# EAGLE board FishTankControllerV2 (EAGLE 9.6.2)
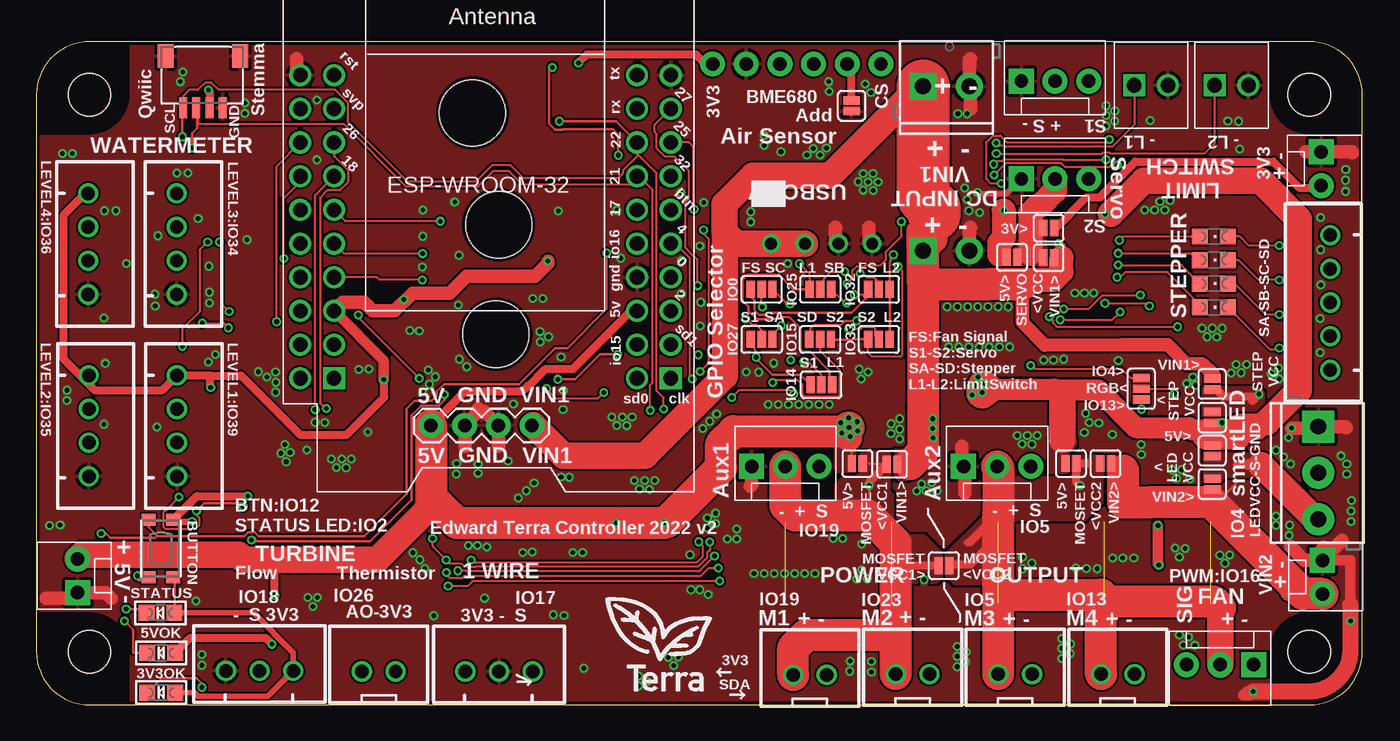
[diagram p2: board, top side]
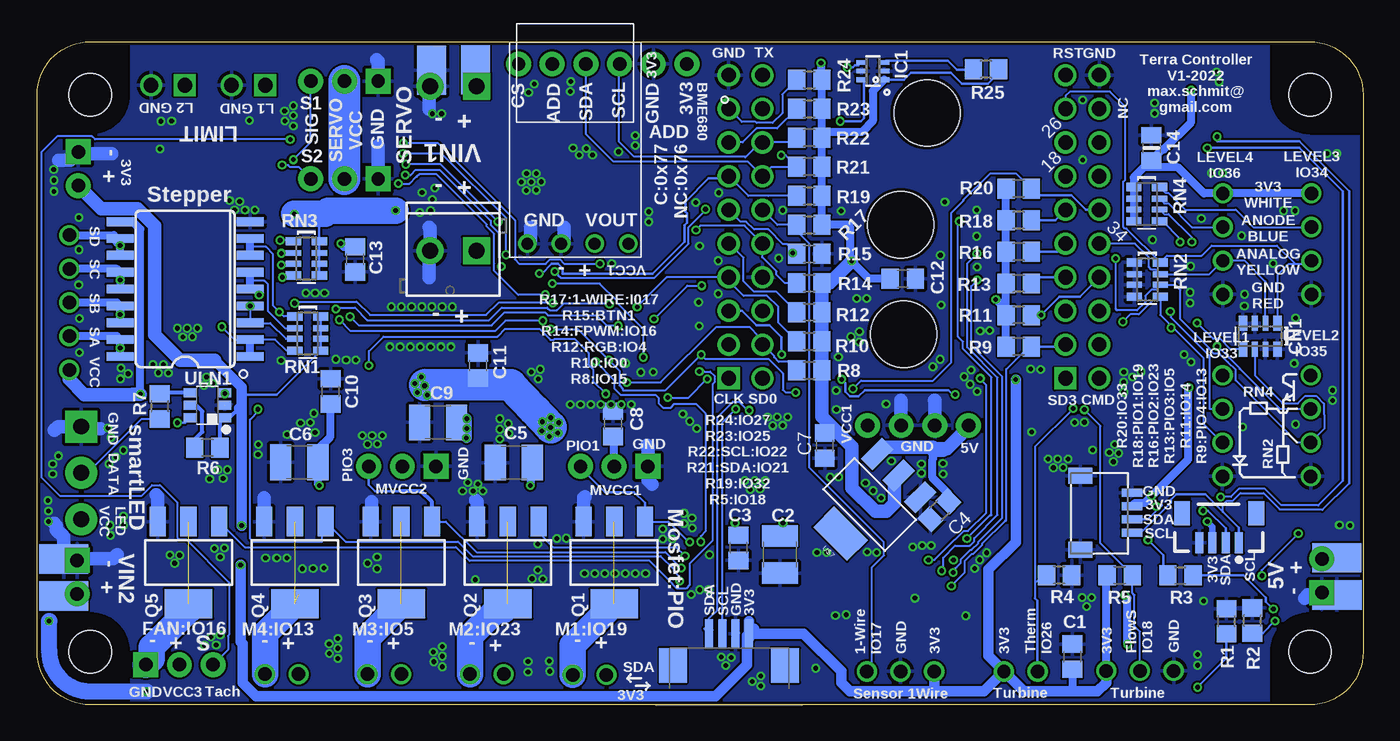
[diagram p3: board, bottom side, seen from below]

Size 100 x 50 mm. Coordinates in mm from the lower left corner, seen from the top.
Copper layers (1*16): Top 0.035mm / dielectric 1.5mm / Bottom 0.035mm
Design rules "dirt_cheap_dirty_boards.v2 *": minimum track width 6mil, minimum drill 12mil, track to track 6mil, track to pad 6mil, pad to pad 6mil, via to via 6mil, smd to smd 0mil, copper to edge 10mil, drill to drill 10mil, minimum pad ring 10mil, minimum via ring 6mil, stop-mask expansion 2mil, vias tented up to drill 25mil, thermal gap 10mil
Net classes: 0 default: clearance 0.127 mm; 1 power: width 0.127 mm, drill 0.305 mm; 2 lowpower: width 0.254 mm, drill 0.483 mm; 3 usbvcc: width 0.127 mm, drill 0.305 mm, clearance 0.254 mm to class 0, clearance 0.254 mm to class 1, clearance 0.254 mm to class 2, clearance 0.254 mm; 4 ThermoDiode: clearance 0.025 mm
Holes 5 mm at 34.86,36.2 32.88,44.63 34.66,27.95

## Footprints (pad centres in the part's own frame; a part is rotated, then mirrored left to right if it is on the bottom)
CHIPLED_0805 = smd 1.2 x 1.2: A 0,-1.05; C 0,1.05
DBV-R-PDSO-G6 = smd 0.69 x 0.99: 1 -0.95,-1.29; 2 0,-1.29; 3 0.95,-1.29; 4 0.95,1.3; 5 0,1.3; 6 -0.95,1.3
TESTHOOK = smd 2.2 x 3.7: P$1 0,0
BTN_KMR2_4.6X2.8 = smd 0.914 x 1.041: A 2.177,0.927; A' -2.177,0.927; B 2.177,-0.927; B' -2.177,-0.927
C805 = smd 1.3 x 1.5: 1 -0.95,0; 2 0.95,0
C1210 = smd 1.6 x 2.7: 1 -1.4,0; 2 1.4,0
0805-NO = smd 1.24 x 1.5: 1 -0.95,0; 2 0.95,0
RN8P-4R-CRA06S = smd 0.63 x 1.15: 1 -1.295,-0.975; 4 1.295,-0.975; 5 1.295,0.975; 8 -1.295,0.975 | smd 0.44 x 1.15: 2 -0.4,-0.975; 3 0.4,-0.975; 6 0.4,0.975; 7 -0.4,0.975
JST_SH4 = smd 0.6 x 1.55: 1 -1.5,2.514; 2 -0.5,2.514; 3 0.5,2.514; 4 1.5,2.514 | smd 1.2 x 1.8: MT1 -2.8,-1.386; MT2 2.8,-1.386
SC70-6L = smd 0.35 x 0.8: 1 -0.65,-0.85; 2 0,-0.85; 3 0.65,-0.85; 4 0.65,0.85; 5 0,0.85; 6 -0.65,0.85
SMT-JUMPER_3_2-NC_PASTE_SILK = smd 0.635 x 1.27: 1 -0.813,0; 2 0,0; 3 0.813,0
MOLEX-1X3 = drill 1.016 pad 1.88 square: 1 0,0 | drill 1.016 pad 1.88: 2 2.54,0; 3 5.08,0
MOLEX-1X2 = drill 1.016 pad 1.88 square: 1 0,0 | drill 1.016 pad 1.88: 2 2.54,0
SCREWTERMINAL-3.5MM-3 = drill 1.2 pad 2.413 square: 1 0,0 | drill 1.2 pad 2.413: 2 3.5,0; 3 7,0
SCREWTERMINAL-3.5MM-2 = drill 1.2 pad 2.032 square: 1 0,0 | drill 1.2 pad 2.032: 2 3.5,0
CONN_282834-2 = drill 1.1 square: 1 -1.27,0 | drill 1.1: 2 1.27,0
1X06_NO_SILK = drill 1.016 pad 1.88: 1 0,0; 2 2.54,0; 3 5.08,0; 4 7.62,0; 5 10.16,0; 6 12.7,0
1X04 = drill 1.016 pad 1.88: 1 0,0; 2 2.54,0; 3 5.08,0; 4 7.62,0
JST-4-SMD-VERT-1.0MM = smd 0.6 x 1.55: 1 -2.54,1.27; 2 -1.54,1.27; 3 -0.547,1.27; 4 0.46,1.27 | smd 1.2 x 1.8: P$1 -3.84,-0.955; P$2 1.753,-0.955
SMT-JUMPER_2_NC_PASTE_SILK = smd 0.635 x 1.27: 1 -0.406,0; 2 0.406,0
FPC_CONN_DOC_4PIN_ENLARGED = smd 0.6 x 2.2: 1 -1.5,1.1; 2 -0.5,1.1; 3 0.5,1.1; 4 1.5,1.1 | smd 2.105 x 2.6: Z1 -4.227,-1.3; Z2 4.227,-1.3
JST-XH-04-PACKAGE-ROUND-PAD = drill 1.016: 1 -3.81,0; 2 -1.27,0; 3 1.27,0; 4 3.81,0
DP10050_V1 = hole 3.2: -46,-21; 46,-21; 46,21; -46,21
SOT223 = smd 1.219 x 2.235: 1 -2.311,-3.099; 2 0,-3.099; 3 2.311,-3.099 | smd 3.6 x 2.2: 4 0,3.099
R805 = smd 1.3 x 1.5: 1 -0.95,0; 2 0.95,0
LED-805 = smd 1.2 x 1.2: A 0,-1.05; C 0,1.05
MH-ET_ESP32_D1_MINI = drill 1.11 pad 1.665: 3V3 25.4,-5.08; CMD 27.94,0; GND 0,-22.86; GND2 2.54,-7.62; GND3 27.94,-22.86; IO0 0,-7.62; IO2 0,-5.08; IO4 0,-10.16; IO5 25.4,-7.62; IO16 2.54,-10.16; IO17 2.54,-12.7; IO18 25.4,-15.24; IO19 25.4,-12.7; IO21 2.54,-15.24; IO22 2.54,-17.78; IO23 25.4,-10.16; IO25 0,-17.78; IO26 25.4,-17.78; IO27 0,-20.32; IO32 0,-15.24; IO33 27.94,-12.7; IO34 27.94,-10.16; IO35 27.94,-15.24; NC 27.94,-20.32; NC2 27.94,-5.08; RST 25.4,-22.86; RXD 2.54,-20.32; SD0 2.54,0; SD1 0,-2.54; SD2 27.94,-2.54; SVN 27.94,-17.78; SVP 25.4,-20.32; TCK 25.4,-2.54; TD0 2.54,-2.54; TDI 0,-12.7; TMS 27.94,-7.62; TXD 2.54,-22.86; VCC 2.54,-5.08 | drill 1.11 pad 1.665 square: CLK 0,0; SD3 25.4,0
USB-PDTRIGGER = drill 0.9: P$1 -3.683,-0.254; P$2 -1.143,-0.254; P$3 1.397,-0.254; P$4 3.937,-0.254
SO18L = smd 0.66 x 2.032: 1 -0.635,-4.902; 2 0.635,-4.902; 3 1.905,-4.902; 4 3.175,-4.902; 5 4.445,-4.902; 6 5.715,-4.902; 7 6.985,-4.902; 8 8.255,-4.902; 9 9.525,-4.902; 10 9.525,4.902; 11 8.255,4.902; 12 6.985,4.902; 13 5.715,4.902; 14 4.445,4.902; 15 3.175,4.902; 16 1.905,4.902; 17 0.635,4.902; 18 -0.635,4.902
JST-XH-02-PACKAGE-ROUND-PAD = drill 1.016: 1 -1.27,0; 2 1.27,0
JST-XH-03-PACKAGE-ROUND-PAD = drill 1.016: 1 -2.54,0; 2 0,0; 3 2.54,0
JST-XH-05-PACKAGE-ROUND-PAD = drill 1.016: 1 -5.08,0; 2 -2.54,0; 3 0,0; 4 2.54,0; 5 5.08,0

## Placement (x,y rotation side)
3V3OK  RED  [CHIPLED_0805]  9.41,0.92 90 top
5VOK  RED  [CHIPLED_0805]  9.41,3.92 90 top
74LVC1  IC_BUFF_SN74LVC1T45DBV  [DBV-R-PDSO-G6]  87.16,22.59 90 bottom
$$U$1  TESTHOOK  [TESTHOOK]  1.99,11.08 90 bottom
BUTTON  KMR2  [BTN_KMR2_4.6X2.8]  9.39,11.79 90 top
C1  [C805]  21.93,3.64 90 bottom
C2  [C1210]  43.98,11.33 270 bottom
C3  [C805]  47.1,11.84 90 bottom
C4  10uf  [C805]  31.95,14.66 225 bottom
C5  [C1210]  64.05,18.27 180 bottom
C6  [C1210]  80.23,18.29 180 bottom
C7  10uf  [C805]  40.6,19.54 270 bottom
C8  [C805]  56.55,21.19 270 bottom
C9  100uf  [C1210]  69.76,21.29 180 bottom
C10  [C805]  77.86,23.63 270 bottom
C11  4,7uf  [C805]  66.74,25.58 90 bottom
C12  4,7uf  [C805]  34.71,32.14 0 bottom
C13  [C805]  76.01,33.59 90 bottom
C14  4,7uF  [0805-NO]  15.96,41.99 90 bottom
CN1  [RN8P-4R-CRA06S]  7.76,27.79 180 bottom
CONN1  STEMMA_I2C_QT  [JST_SH4]  12.56,47.53 180 top
CONN2  STEMMA_I2C_QT  [JST_SH4]  19.94,14.49 270 bottom
IC1  LTC4311_SC70  [SC70-6L]  36.97,47.78 90 bottom
IO0  JUMPER-SMT_3_2-NC_PASTE_SILK  [SMT-JUMPER_3_2-NC_PASTE_SILK]  54.7,31.34 0 top
IO14  JUMPER-SMT_3_2-NC_PASTE_SILK  [SMT-JUMPER_3_2-NC_PASTE_SILK]  59.19,24.14 0 top
IO15  JUMPER-SMT_3_2-NC_PASTE_SILK  [SMT-JUMPER_3_2-NC_PASTE_SILK]  59.11,27.55 0 top
IO25  JUMPER-SMT_3_2-NC_PASTE_SILK  [SMT-JUMPER_3_2-NC_PASTE_SILK]  59.12,31.34 180 top
IO27  JUMPER-SMT_3_2-NC_PASTE_SILK  [SMT-JUMPER_3_2-NC_PASTE_SILK]  54.7,27.55 180 top
IO32  JUMPER-SMT_3_2-NC_PASTE_SILK  [SMT-JUMPER_3_2-NC_PASTE_SILK]  63.54,31.34 0 top
IO33  JUMPER-SMT_3_2-NC_PASTE_SILK  [SMT-JUMPER_3_2-NC_PASTE_SILK]  63.54,27.55 0 top
J1  [MOLEX-1X3]  91.81,3.03 180 top
J2  [MOLEX-1X2]  3.11,8.46 90 top
J3  [MOLEX-1X2]  96.99,10.9 270 top
J4  [SCREWTERMINAL-3.5MM-3]  96.69,20.99 270 top
J5  [MOLEX-1X2]  96.89,41.69 270 top
J6  [SCREWTERMINAL-3.5MM-2]  66.87,46.64 0 top
J7  282834-2  [CONN_282834-2]  84.06,46.72 0 top
J8  282834-2  [CONN_282834-2]  90.13,46.72 0 top
J9  [1X06_NO_SILK]  63.69,48.32 180 top
J10  [SCREWTERMINAL-3.5MM-2]  66.87,34.25 180 bottom
J11  [1X04]  29.76,21.06 0 top
J12  [JST-4-SMD-VERT-1.0MM]  11.9,13.49 180 bottom
JP1  JUMPER-SMT_2_NC_PASTE_SILK  [SMT-JUMPER_2_NC_PASTE_SILK]  68.44,10.5 0 top
JP3  JUMPER-SMT_2_NC_PASTE_SILK  [SMT-JUMPER_2_NC_PASTE_SILK]  88.67,16.64 270 top
JP4  JUMPER-SMT_2_NC_PASTE_SILK  [SMT-JUMPER_2_NC_PASTE_SILK]  64.53,18.14 0 top
JP5  JUMPER-SMT_2_NC_PASTE_SILK  [SMT-JUMPER_2_NC_PASTE_SILK]  61.91,18.19 180 top
JP6  JUMPER-SMT_2_NC_PASTE_SILK  [SMT-JUMPER_2_NC_PASTE_SILK]  78.02,18.19 180 top
JP7  JUMPER-SMT_2_NC_PASTE_SILK  [SMT-JUMPER_2_NC_PASTE_SILK]  80.63,18.19 0 top
JP8  JUMPER-SMT_2_NC_PASTE_SILK  [SMT-JUMPER_2_NC_PASTE_SILK]  88.67,19.16 90 top
JP9  JUMPER-SMT_2_NC_PASTE_SILK  [SMT-JUMPER_2_NC_PASTE_SILK]  88.67,21.67 270 top
JP10  JUMPER-SMT_2_NC_PASTE_SILK  [SMT-JUMPER_2_NC_PASTE_SILK]  88.67,24.19 90 top
JP11  JUMPER-SMT_2_NC_PASTE_SILK  [SMT-JUMPER_2_NC_PASTE_SILK]  76.34,33.71 0 top
JP12  JUMPER-SMT_2_NC_PASTE_SILK  [SMT-JUMPER_2_NC_PASTE_SILK]  73.57,33.74 180 top
JP13  JUMPER-SMT_2_NC_PASTE_SILK  [SMT-JUMPER_2_NC_PASTE_SILK]  76.34,35.95 0 top
JP14  JUMPER-SMT_2_NC_PASTE_SILK  [SMT-JUMPER_2_NC_PASTE_SILK]  61.48,45.17 270 top
K1  FPC4PIN_1MM_MAX  [FPC_CONN_DOC_4PIN_ENLARGED]  47.82,4.27 0 bottom
LEVEL1-IO39  JST-XH-04-PIN-ROUND-PAD  [JST-XH-04-PACKAGE-ROUND-PAD]  10.6,21.04 270 top
LEVEL2-IO35  JST-XH-04-PIN-ROUND-PAD  [JST-XH-04-PACKAGE-ROUND-PAD]  3.95,21.04 270 top
LEVEL3-IO34  JST-XH-04-PIN-ROUND-PAD  [JST-XH-04-PACKAGE-ROUND-PAD]  3.9,34.75 270 top
LEVEL4-IO36  JST-XH-04-PIN-ROUND-PAD  [JST-XH-04-PACKAGE-ROUND-PAD]  10.58,34.75 270 top
PCB1  PCB_DP_RECTANGLE-50X100  [DP10050_V1]  50,25 0 top
Q1  VNN7NV04  [SOT223]  56.48,10.73 180 bottom
Q2  VNN7NV04  [SOT223]  64.5,10.73 180 bottom
Q3  VNN7NV04  [SOT223]  72.53,10.73 180 bottom
Q4  VNN7NV04  [SOT223]  80.56,10.73 180 bottom
Q5  VNN7NV04  [SOT223]  88.58,10.73 180 bottom
R1  1k  [R805]  10.3,6.31 90 bottom
R2  1k  [R805]  8.34,6.36 90 bottom
R3  1k  [R805]  13.78,9.76 0 bottom
R4  10k  [R805]  22.92,9.79 180 bottom
R5  10k  [R805]  18.35,9.79 0 bottom
R6  [R805]  87.16,19.39 180 bottom
R7  330  [R805]  90.74,22.51 90 bottom
R8  10k  [R805]  41.76,25.23 0 bottom
R9  10k  [R805]  25.97,27.01 180 bottom
R10  10k  [R805]  41.76,27.42 0 bottom
R11  10k  [R805]  25.97,29.39 180 bottom
R12  10k  [R805]  41.76,29.61 0 bottom
R13  10k  [R805]  25.97,31.77 180 bottom
R14  10k  [R805]  41.76,31.81 0 bottom
R15  10K  [R805]  41.76,34 0 bottom
R16  10k  [R805]  25.97,34.15 180 bottom
R17  4,7k  [R805]  41.76,36.19 0 bottom
R18  10k  [R805]  25.97,36.54 180 bottom
R19  10k  [R805]  41.76,38.37 0 bottom
R20  10k  [R805]  25.97,38.92 180 bottom
R21  [R805]  41.76,40.56 180 bottom
R22  [R805]  41.76,42.75 180 bottom
R23  10k  [R805]  41.76,44.94 0 bottom
R24  10k  [R805]  41.76,47.12 0 bottom
R25  10K  [R805]  28.44,47.91 180 bottom
RGB  JUMPER-SMT_3_2-NC_PASTE_SILK  [SMT-JUMPER_3_2-NC_PASTE_SILK]  83.32,23.83 90 top
RN1  [RN8P-4R-CRA06S]  79.59,28 270 bottom
RN2  4,3k  [RN8P-4R-CRA06S]  16.27,32.06 270 bottom
RN3  [RN8P-4R-CRA06S]  79.69,33.66 270 bottom
RN4  330  [RN8P-4R-CRA06S]  16.32,37.75 270 bottom
S1  [LED-805]  88.8,29.98 270 top
S2  [LED-805]  88.8,31.76 270 top
S3  [LED-805]  88.8,33.53 270 top
S4  [LED-805]  88.8,35.31 270 top
SERVO1  [MOLEX-1X3]  53.94,17.98 0 top
SERVO2  [MOLEX-1X3]  69.91,17.98 0 top
SERVO3  [MOLEX-1X3]  74.28,39.66 0 top
SERVO4  [MOLEX-1X3]  74.28,47.02 0 top
STATUS  RED  [CHIPLED_0805]  9.36,6.94 90 top
U$1  LOGOTOPTERRA  [LOGOTOPTERRA]  46.72,0.95 0 top
U$3  MH-ET_ESP32_D1_MINI  [MH-ET_ESP32_D1_MINI]  47.84,24.62 180 top
U$4  TESTHOOK  [TESTHOOK]  98.01,8.21 90 bottom
U$5  TESTHOOK  [TESTHOOK]  1.97,8.29 270 bottom
U$6  TESTHOOK  [TESTHOOK]  98.01,11 270 bottom
U$7  V_REG_LD1117VXXLD1117-SMD  [SOT223]  37.22,15.1 135 bottom
U$8  USB_PD_TRIGGER  [USB-PDTRIGGER]  59.35,35.03 0 bottom
U$9  TESTHOOK  [TESTHOOK]  70.24,47.83 0 bottom
U$10  TESTHOOK  [TESTHOOK]  66.94,47.89 0 bottom
ULN1  STEPPER-DRIVER  [SO18L]  88.84,26.91 90 bottom
X1  JST-XH-02-PIN-ROUND-PAD  [JST-XH-02-PACKAGE-ROUND-PAD]  58.33,2.27 0 top
X2  JST-XH-02-PIN-ROUND-PAD  [JST-XH-02-PACKAGE-ROUND-PAD]  66.09,2.32 0 top
X3  JST-XH-02-PIN-ROUND-PAD  [JST-XH-02-PACKAGE-ROUND-PAD]  73.82,2.32 0 top
X4  JST-XH-02-PIN-ROUND-PAD  [JST-XH-02-PACKAGE-ROUND-PAD]  81.55,2.32 0 top
X5  JST-XH-03-PIN-ROUND-PAD  [JST-XH-03-PACKAGE-ROUND-PAD]  34.89,2.52 0 top
X6  JST-XH-02-PIN-ROUND-PAD  [JST-XH-02-PACKAGE-ROUND-PAD]  25.82,2.52 0 top
X7  JST-XH-03-PIN-ROUND-PAD  [JST-XH-03-PACKAGE-ROUND-PAD]  16.83,2.57 0 top
X8  JST-XH-05-PIN-ROUND-PAD  [JST-XH-05-PACKAGE-ROUND-PAD]  97.57,30.33 90 top

## Tracks (layer width: path | path; a pad name or v marks a point on that pad's centre or on a via)
1-WIRE
  Bottom 0.152: U$3.IO17 44.17,36.19 R17.1 42.71,35.72 41.75,34.77 41.75,17.88 36.14,12.27 36.14,11.73 36.13,11.73 36.13,11.27 37.05,10.36 37.05,2.9 X5.3
3V3  (via drill 0.35)
  Top 0.2: BUTTON.B' 10.41,9.52 STATUS.A | 25.06,30 25.67,30 25.97,29.7 | 25.08,29.7 25.36,29.7 | v27.7,30.56 27.7,30.39 27.01,29.7
  Top 0.4: STATUS.A 16.37,6.94 19.37,3.94 X7.3 17.44,0.65 12.2,0.65 11.93,0.92 3V3OK.A
  Top 0.5: v11.75,13.82 10.46,13.82 BUTTON.B
  Top 0.6: LEVEL2-IO35.1 3.26,24.85 | 3.26,24.85 4.38,23.73 9.49,23.73 LEVEL1-IO39.1 13.12,24.85 13.12,24.82 | 3.26,24.85 2.07,26.04 2.07,36.94 3.7,38.56 LEVEL3-IO34.1 | 13.12,24.82 15.43,24.82 19.88,20.38 23.41,20.38 26.23,23.2 26.23,24.49 v26.2,24.52 | 25.97,29.7 25.08,29.7 24.92,29.86 | v13.14,23.93 13.12,23.96 13.12,24.82 | BUTTON.B 12.09,15.75 v15.96,15.75 | v12.97,46.36 13.06,46.27 CONN1.2 | JP13.2 76.87,35.95 79.19,38.26 80.19,38.26 82.88,40.95 93.28,40.95 95.24,39 96.74,39 J5.2 | J9.6 50.46,48.32 49.75,49.03 41.52,49.03 v40.88,48.39
  Top 0.8: U$3.3V3 26.2,25.94 v26.2,24.52 | v84.65,10.55 84.57,10.62 v84.57,13.52
  Top 1: U$3.3V3 23.11,30.37 24.69,30.37 25.06,30 25.36,29.7 25.97,29.7 27.01,29.7 28.36,31.05 28.38,31.03 31.16,31.03 32.45,32.31 37.61,32.31 38.57,33.28 v38.57,33.46
  Bottom 0.2: RN1.8 RN1.7 RN1.6 RN1.5 81.94,23.37 84.49,23.37 84.57,23.3 | IC1.1 34.62,47.13 34.09,47.67 31.09,47.67 30.26,46.84 28.28,46.84 27.49,47.64 R25.1 | C14.1 16.02,41.04 16.55,40.52 | 74LVC1.1 85.51,21.64
  Bottom 0.3: R6.1 86.21,21.3 74LVC1.1 | 85.51,21.64 84.77,22.38 84.57,22.58
  Bottom 0.4: 46.32,5.04 K1.4
  Bottom 0.5: J12.3 11.35,13.43 v11.75,13.82
  Bottom 0.6: R9.2 R11.2 26.92,29.79 | 26.92,29.79 R13.2 R16.2 R18.2 R20.2 | v27.7,30.56 26.92,29.79 | LEVEL3-IO34.1 LEVEL4-IO36.1 12,38.56 13.96,40.52 16.55,40.52 17.29,39.77 RN4.1 RN4.2 RN4.3 RN4.4 | 40.81,43.19 R22.1 R21.1 R19.2 R17.2 38.86,36.19 38.67,36 38.67,33.56 v38.57,33.46 37.25,32.14 C12.1 | 40.81,43.19 R23.2 R24.2 40.88,47.2 v40.88,48.39 | 40.81,30.92 R14.2 | X7.3 19.37,9.72 R5.1 | CONN2.2 17.18,15.23 16.47,15.23 v15.96,15.75 13.2,18.51 13.2,23.88 v13.14,23.93 | C1.1 21.93,1.02 | C7.1 40.6,21.55 40.79,21.74 | IC1.1 36.97,46.28 36.97,44.02 37.81,43.19 40.81,43.19 | C14.1 15.14,41.87 15.03,41.87 12.97,43.93 v12.97,46.36
  Bottom 0.8: 46.32,5.04 46.32,6.3 | K1.4 45.93,5.75 | v26.2,24.52 26.2,12.27 28.26,10.22 28.26,3.69 X6.2 | X6.2 25.59,1.02 21.93,1.02 20.03,1.02 19.37,1.68 X7.3 19.3,2.64 | X6.2 28.59,1.02 32.32,1.02 | 32.32,1.02 38.7,1.02 39.36,1.68 39.36,2.52 42.21,5.37 K1.4 | K1.4 46.46,5.23 46.46,3.03 48.84,0.65 83.49,0.65 84.49,1.66 84.49,4.6 84.65,4.76 v84.65,10.55 | v84.57,13.52 84.57,22.18 | 86.6,25.99 84.57,23.96 84.57,23.3 84.57,22.58 84.57,22.18 | X5.1 32.35,1.05 32.32,1.02 | 84.57,22.18 84.77,22.38
  Bottom 1: J5.2 95.15,37.41 92.41,37.41 91.12,36.13 91.12,27.92 89.19,25.99 86.6,25.99 | U$7.2 35.35,16.96 35.35,15.18 35.93,14.61 36.79,14.61 38.53,16.35 38.53,19.48 40.79,21.74 40.81,21.75 R8.2 R10.2 R12.2 40.81,30.92 | R14.2 40.22,31.81 v38.57,33.46
5V  (via drill 0.35)
  Top 0.152: JP5.2 61.51,20.68 v61.28,20.91 | v60.67,21.27 61.02,20.91 v61.28,20.91 | v60.72,20.5 61.13,20.91 v61.28,20.91 | JP12.2 72.82,33.74 72.61,33.95 | J11.1 29.76,21.11
  Top 0.2: 77.37,20 77.83,19.54 | v89.42,21.27 90.26,20.43 90.61,20.43
  Top 0.4: v43.75,13.72 43.75,13.14 | v47.36,13.72 47.56,13.52 47.56,13.14 47.57,13.14 47.57,13.8
  Top 0.6: U$3.VCC 44.84,29.7 40.48,25.34 38.41,25.34 37.1,24.04 37.04,24.04 36.64,23.64 32.25,23.64 32.25,23.56 J11.1 | 5VOK.A 11.6,5.06 17.28,5.06 v17.77,4.58 | v17.97,8.26 17.97,10.65 17.67,10.96 | 71.03,24.31 v71.03,24.72 | 71.03,24.31 v70.78,24.06 71.41,24.06 71.67,23.81 | v71.51,24.24 71.11,24.24 71.03,24.31 | v60.67,21.27 60.87,21.27 v61.25,21.65 | v61.89,21.34 61.94,21.29 v61.94,20.66 61.53,20.66 v61.28,20.91 | 88.67,20.9 JP9.2 v89.42,21.27 89.78,21.27 90.51,20.53 | 88.67,20.9 88.2,20.43 | 88.79,21.01 88.67,20.9 | JP8.2 88.2,20.03 88.2,20.25 88.2,20.43 | 90.61,20.43 90.51,20.53 | 90.61,20.43 90.94,20.76 90.94,21.67 | 92.8,21.32 92.8,21.06 92.7,20.96 92.01,20.96 | 90.61,20.43 90.61,20.76 90.28,20.43 88.2,20.43 | 90.61,20.43 90.61,20.25 | 90.74,20.96 90.54,20.96 90.51,20.94 90.51,20.53 | v80.61,37.01 81.04,37.01
  Top 1.6: 76.8,23.76 80.07,23.76 82.92,20.91 86.93,20.91 87.08,20.76 90.61,20.76 | 71.67,23.81 76.75,23.81 76.8,23.76 | 76.8,23.76 77.37,23.18
  Top 1.8: v72.96,37.27 72.96,35.16 72.61,34.81 72.61,33.95
  Top 2: 30.4,15.03 29.76,15.68 29.76,14.84 | 88.2,20.25 90.61,20.25 | 77.37,23.18 77.37,20 | v61.28,20.91 61.28,20.13 61.27,20.12 | 92.01,20.96 90.74,20.96 | 92.8,21.32 95.21,23.73 95.21,36.61 92.32,39.5 83.52,39.5 81.04,37.01 | J2.2 3.42,11.31 15.26,11.31 15.61,10.96 17.67,10.96 25.69,10.96 29.76,15.02
  Top 2.4: 29.76,14.84 29.76,15.02 29.76,21.11 | 30.4,15.03 31.71,13.72 v43.75,13.72 v47.36,13.72 | 47.57,13.8 51.64,17.88 51.64,19.68 52.6,20.63 61,20.63 v61.28,20.91 | v71.31,23.55 71.34,23.58 71.34,23.76 71.39,23.81 71.39,23.96 71.45,24.02 71.67,23.81
  Bottom 0.2: RN3.5 RN3.6 RN3.7 RN3.8 78.72,36.59 78.3,37.01 78.04,37.27 | v43.75,13.72 43.75,13.42 43.73,13.39 | v61.38,20.23 61.28,20.33 v61.28,20.91 | 74LVC1.6 88.83,21.27 v89.42,21.27 | $$U$1.P$1 3.04,11.08 J2.2 | 62.54,22.27 64.33,24.06 70.42,24.06 v70.78,24.06
  Bottom 0.4: 43.73,13.39 43.73,13.16 43.75,13.14 | C2.1 43.75,12.96 v43.75,13.72 | C3.2 47.36,13.05 v47.36,13.72
  Bottom 0.6: v17.77,4.58 17.77,8.06 v17.97,8.26 | v71.31,23.55 71.21,23.55 71.01,23.35 v70.57,23.35 | C11.1 69.85,24.63 70.42,24.06 | C4.1 31.28,15.93 32.47,17.12 32.47,18.53 32.42,18.57 32.42,19.21 32.42,19.44
  Bottom 1: U$7.3 36.15,19.44 34.86,19.44 32.42,19.44 | 31.69,19.21 32.42,19.21 32.31,19.32 31.38,19.32 29.76,20.95 J11.1
  Bottom 2: v80.61,37.01 78.3,37.01 | 78.04,37.27 v72.96,37.27
  Bottom 2.4: 70.76,24.13 64.27,24.11 62.54,22.27 61.28,20.94 v61.28,20.91
  pour Top (no thermals): 76.34,19.89 76.34,17.46 77.79,17.48 77.84,17.53 77.84,19.01 78.42,19.59 78.42,19.97 78.24,20.15 76.49,20.15 76.31,19.97
  pour Top (no thermals): 62.04,19.64 61.73,19.34 61.73,17.53 60.44,17.53 60.19,17.79 60.19,19.77 60.26,19.84 61.94,19.84 62.04,19.74
ANODEA0  (via drill 0.35)
  Top 0.152: v13.8,34.91 13.98,34.73 13.98,30.21 v14.54,29.65
  Bottom 0.152: RN4.5 15.12,36.46 13.8,35.15 v13.8,34.91 | v14.54,29.65 14.52,29.62 14.52,29.24 11.6,26.32 11.6,22.31 LEVEL1-IO39.2
ANODEA1  (via drill 0.35)
  Top 0.152: v12.92,34.91 12.31,34.3 12.31,29.64 11.01,28.35 v11.01,27.03
  Bottom 0.152: RN4.6 14.99,37 14.67,37 12.92,35.24 v12.92,34.91 | LEVEL2-IO35.2 6.29,22.31 9.31,25.33 9.31,25.38 10.09,26.17 10.1,26.17 10.71,26.78 10.76,26.78 v11.01,27.03
ANODEA2
  Bottom 0.152: RN4.7 14.99,37.8 14.67,37.8 12.9,36.02 LEVEL4-IO36.2
ANODEA3
  Bottom 0.152: RN4.8 14.9,38.6 14.67,38.6 13.42,37.34 9.61,37.34 8.29,36.02 LEVEL3-IO34.2
BTN1  (via drill 0.35)
  Top 0.152: v43.01,34.08 43.01,33.46
  Top 0.2: BUTTON.A 8.46,13.38 9.09,12.74 | 9.09,12.74 9.13,12.71 15.68,12.71 15.99,13.02 16.47,13.02 16.78,12.71 24.73,12.71 27.93,15.91 27.93,22.31 28.54,22.92 29.81,22.92 30.19,23.3 30.19,23.64 30.74,24.19 36.41,24.19 39.13,26.91 40.04,26.91 43.01,29.87 43.01,33.46 | v4.89,12.91 5.27,12.91 5.58,12.61 8.95,12.61 9.09,12.74
  Top 0.6: BUTTON.A' 7.75,9.62 v7.63,9.73
  Bottom 0.152: U$3.TDI 46.95,36.43 46.52,36.43 45.93,35.84 44.86,35.84 43.75,34.73 43.44,34.73 R15.1 42.78,34.08 v43.01,34.08
  Bottom 0.2: v7.63,9.73 7.63,10.17 v4.89,12.91
EN
  Bottom 0.2: IC1.3 35.99,48.56 31.32,48.56 30.65,47.89 29.41,47.89 R25.2
FANCOUNTER  (via drill 0.35)
  Top 0.152: 62.57,30.66 62.32,30.92 v61.68,30.92 | v72.76,39.3 72,39.3 71.64,39.66 71.64,42.42 72.15,42.92 72.7,42.92 | 72.7,42.92 72.71,42.93 | 72.7,42.92 73.19,42.43 73.19,42.42 73.2,42.41 80.7,42.41 v80.91,42.63
  Top 0.2: IO0.1 53.95,31.27 53.95,30.71 54.17,30.49 54.17,29.76 54.51,29.42 54.99,29.42 55.14,29.57 61.48,29.57 62.57,30.66 62.57,31.19 IO32.1
  Bottom 0.152: v61.68,30.92 63.72,30.92 65.54,32.74 65.54,33.28 65.53,33.29 65.53,35.5 66.1,36.07 66.1,36.22 69.89,40.01 71.16,40.01 71.36,39.81 71.41,39.81 71.92,39.3 v72.76,39.3 | v80.91,42.63 95.62,42.63 95.85,42.86 98.49,42.86 99.67,41.68 99.67,17.15 98.3,15.78 92.1,15.78 91.32,16.56 90.72,16.56 89.42,15.26 89.42,12.61 89.29,12.48 88.76,12.48 85.51,9.23 85.51,5.29 85.6,5.19 85.6,4.15 J1.3
FANGND  (1 unrouted)
  Bottom 2: J1.1 91.36,3.48 91.36,4.35 88.58,7.13 Q5.4
FANPWM  (via drill 0.35)
  Top 0.152: v50.31,35.79 50.31,35.51 50.69,35.13 50.69,25.76 v50.05,25.13
  Bottom 0.152: R14.1 | R14.1 43.62,31.81 44.24,32.42 44.24,32.68 45.3,33.74 U$3.IO16 46.65,36.13 49.97,36.13 v50.31,35.79 | Q5.1 84.34,11.89 68.41,11.89 67.37,10.85 53.81,10.85 52.08,9.12 52.08,9.1 51.75,8.77 51.06,8.77 50.79,9.05 50.79,10.65 49.06,12.38 49.06,24.19 48.91,24.34 48.91,24.8 49.24,25.13 49.7,25.13 49.87,24.95 50.23,24.95 v50.05,25.13
GND  (via drill 0.35)
  Top 0.4: SERVO3.1 73.16,38.54 71.05,38.54 v70.96,38.63
  Top 0.8: J3.1 99.07,10.9 99.07,7.5 | v91.76,1 91.48,0.72 91.02,0.72 91.3,1 v91.76,1
  Top 1: J3.1 98.46,12.38 98.46,12.43 | 99.25,41.64 99.2,41.69 J5.1 95.72,41.69 | 94.67,20.85 94.69,20.87 96.57,20.87 J4.1 98.69,20.99 98.79,20.89 | 69.81,19.49 69.81,18.08 SERVO2.1 70.02,17.88 70.02,16.01 | SERVO1.1 53.94,16.57 53.84,16.47 | 5.65,8.06 5.25,8.46 J2.1 2.71,8.06 0.75,8.06 | U$3.GND3 19.62,47.76 19.62,48.7 | U$8.P$1 62.8,35.01 62.8,36 | U$8.P$2 60.26,35.01 60.26,36 | J10.2 70.37,35.86 70.37,35.87 70.37,35.95 70.42,36 | 70.42,48.7 70.37,48.64 J6.2 70.42,46.59 70.42,44.89 | 33.36,22.13 J11.2 32.32,21.04 32.32,19.49 | 33.36,22.13 33.36,22.33 | 33.36,22.13 33.77,22.13 J11.3 34.86,21.04 34.86,19.49 | J3.1 95.6,10.9 94.59,11.91 | J3.1 96.99,11.77 97.09,11.87
  Top 1.2: 99.07,7.5 99.1,7.53 v99.1,6.33 99.1,4.17 arc-90 95.92,1 v91.76,1
  Bottom 0.2: U$5.P$1 2.93,8.29 J2.1
  Bottom 1: 93.97,11.34 94.3,11 U$6.P$1 98.01,12.68 98.54,13.22 98.54,13.52 98.72,13.7 | 94.37,41.56 96.76,41.56 J5.1 97.5,41.08 98.36,41.08 | SERVO4.1 74.28,48.52 74.38,48.62 | SERVO3.1 74.28,42.17 | Q4.3 82.87,15.6 | Q3.3 74.79,13.88 74.79,15.3 | Q2.3 66.81,15.3 66.94,15.42 | Q1.3 58.79,15.6 58.69,15.7 | Q5.3 90.89,15.7 91.02,15.83 | 95.24,20.81 96.51,20.81 J4.1 98.41,20.99 98.69,20.71 | 53.63,16.64 53.94,16.95 SERVO1.1 53.94,19.51 53.99,19.56 | U$5.P$1 4.15,8.29 4.38,8.06 | U$8.P$2 60.26,35.01 60.26,36 | U$8.P$1 62.8,35.01 62.8,36 | U$9.P$1 70.42,47.66 70.42,44.89 | 70.42,32.19 70.42,34.19 J10.2 70.37,35.94 70.42,36 | J11.3 34.84,22.95 34.86,22.98 | J11.2 32.3,22.95 32.32,22.98
  Bottom 1.2: v91.76,1 96,1 arc90 99.07,4.07 99.07,6.31 arc-90 v99.1,6.33
  other vias: 89.24,11.28 68.69,30.02 69.46,30.02 70.23,30.02 70.99,30.02 71.76,30.02 72.53,30.02 73.29,30.02 68.8,26.99 69.56,26.99 70.33,26.99 71.09,26.99 71.86,26.99 72.63,26.99 73.39,26.99 55.18,22.65 55.95,22.65 56.71,22.65 57.48,22.65 58.25,22.65 59.01,22.65 59.78,22.65 54.11,9.9 54.88,9.9 55.65,9.9 56.41,9.9 57.18,9.9 57.95,9.9 58.71,9.9 79.03,20.54 79.13,21.99 79.39,21.28 80.12,21.25 81.14,20.39 22.24,18.54 23.03,18.54 22.62,17.9 23.36,17.88 23.76,18.54 18.43,18.97 19.14,19.02 18.83,18.33 18.73,19.63 20.41,19.22 31.69,18.21 37.53,16.73 31.66,17.42 36.33,15.59 36.94,16.15 45.1,16.91 45.89,16.91 45.48,16.28 46.22,16.25 46.62,16.91 43.4,21.71 44.18,21.71 43.78,21.08 44.51,21.05 44.92,21.71 85.1,37.31 84.32,37.31 84.72,37.94 85.48,38.02 83.58,37.31 80.67,43.64 80.67,44.43 81.31,44.02 81.33,44.76 80.67,45.17 87.9,28.39 88.68,28.39 88.28,27.76 89.01,27.73 89.42,28.39 83.3,19.63 85.64,17.72 86.98,17.04 85.97,17.06 86.37,17.72 86.75,24.23 87.21,24.71 87.41,24.1 90.11,25.01 93.13,24.96 77.32,3.49 77.32,4.27 77.95,3.87 77.98,4.6 77.32,5.01 69.44,2.88 69.44,3.66 70.08,3.26 70.1,3.99 69.44,4.4 65.1,21.57 65.1,20.78 64.47,21.19 64.44,20.45 65.1,20.05 67.91,16.12 67.12,16.12 67.53,16.76 66.76,16.66 66.38,16.12 79.03,31.06 78.32,31.06 79.72,31.06 96.81,26.56 96.81,29.13 96.86,31.67 96.84,34.31 96.84,36.75 93.69,25.39 93.71,24.58 90.84,25.04 90.46,25.67 91.27,25.67 52.82,12.52 60.08,12.57 60.79,12.54 62.24,12.13 52.82,13.25 52.11,12.52 50.58,13.33 50.61,14.09 51.22,13.68 75.96,26 76.7,26 77.46,26.05 81.6,25.95 62.74,25.1 62.2,24.57 62.05,25.3 50.25,20.85 50.79,21.38 51.3,21.94 51.22,14.45 49.29,11.32 49.36,8.68 50.03,8.68 50.66,8.32 39.56,26.23 73.95,20.31 74.74,20.31 74.33,19.68 75.07,19.65 75.48,20.31 33.31,18.15 29.1,23.62 33.97,11.91 33.26,12.01 32.58,12.01 37.4,11.53 36.69,11.5 40.45,11.5 41.19,11.5 29.63,24.17 30.09,24.73 29.55,25.24 28.87,28.19 29.1,33.01 29.15,35.33 29.15,37.31 31.89,26.05 32.45,25.5 38.01,27.35 37.99,28.14 38.62,27.76 18.05,23.56 18.07,24.33 18.05,25.09 45.43,1.42 45.43,2.18 46.06,1.77 47.66,3.58 48.4,3.6 48.07,2.97 28.38,11.47 28.92,10.94 29.3,10.28 17.39,24.71 16.75,25.11 93.48,19.2 94.04,18.69 94.58,18.15 94.42,20.16 94.65,20.87 87.36,4.49 86.5,4.51 50.04,34.6 50.32,37.88 48.64,33.48 48.64,30.99 50.11,30.36 50.06,28.56 53.54,25.1 54.48,25.08 55.6,25.76 48.59,38.61 39.74,23.69 15.74,44.6 15.74,45.38 11.42,40.1 10.6,40.1 8.95,30.07 8.93,30.96 13.04,31.11 13.04,30.3 9.08,20.95 5.09,21.15 2.3,23.72 2.3,22.96 5.09,29.18 5.19,25.75 12.97,25.85 13.5,26.41 0.98,13.53 1.79,13.56 5.14,37.26 6.01,37.26 1.97,41.57 2.73,41.57 10.86,46.98 11.06,47.72 21.15,41.09 21.15,45.61 24.32,25.29 25.08,25.32 33.31,17.47 35.57,18.38 70,38.96 69.49,44.57 70.2,44.57 62.51,46.81 62.94,46.17 59.79,46.25 59.76,46.98 61.97,39.44 62.73,39.41 62.35,40.05 63.09,40.05 63.47,39.41 62.35,38.8 63.11,38.78 58.11,41.45 58.59,41.95 59.1,41.45 59.58,41.98 54.89,42.18 54.89,42.92 56.16,41.7 53.87,36.42 53.87,37.18 44.06,33.67 37.44,30.63 38.2,30.63 39.37,37.23 31.54,37.92 31.87,33.9 31.82,30.14 28.16,28.21 24.99,20.57 21.02,21.3 21.76,21.28 20.49,8.1 21.2,8.1 20.84,7.41 12.48,2.99 12.48,3.8 12.03,7.84 33.79,8.05 29.96,6.72 38.98,6.8 39.79,6.75 41.29,2.76 61.33,2.53 43.76,37.29 70.2,38.09 70.33,37.26 71.14,37.13 89.98,11.31 89.62,10.67 85.86,11.82 86.63,11.79 86.19,11.16 98.72,39.55 98.72,38.72 98.74,40.37 90.74,41.92 89.85,44.02 90.67,44 83.99,44.05 98.39,18.78 98.82,18.17 98.82,17.41 99.17,15.4 99.15,14.61 99.15,13.82 94.48,12.78 94.5,13.54 78.37,10.32 79.18,10.29 80,10.27 81.17,11.08 81.93,11.08 82.77,11.08 74.36,10.27 74.36,11.16 75.07,10.67 61.86,9.48 62.67,9.51 62.24,10.17 66.94,9.43 83.32,18.87 93.48,14.23 93.48,13.54 86.88,5.12 86.19,5.28 62.98,2.48 62.98,3.27 61.38,3.3 35.98,22.68 39.71,22.27 40.2,17.16 39.56,17.19 56.65,33.27 6.79,33.27 13.02,33.06 15.89,35.07 9.16,35.36 12.2,36.66
  pour Bottom: -1.97,49.97 -1.97,-8.45 95.82,-8.45 108.52,4.25 108.52,44.89 98.36,55.05 3.11,55.05
  pour Top (rank 2): -0.88,50.93 -0.88,-1.26 99.91,-1.26 100.65,-0.53 100.65,50.93
  pour Top: 91.76,6.94 91.78,6.94 91.76,7.83
IO0  (via drill 0.35)
  Top 0.152: v54.75,30 54.7,30.05 IO0.2
  Bottom 0.152: R10.1 44.11,28.82 44.11,30.01 44.94,30.84 46.72,30.84 47.84,31.96 U$3.IO0 52.51,32.24 v54.75,30
IO4  (via drill 0.35)
  Top 0.152: v74.97,25.58 75.04,25.58 75.32,25.31 81.85,25.31 82.51,24.64 RGB.3 | v57.11,23.45 56.83,23.73 53,23.73 v52.44,23.17 | v49.47,24.57 49.29,24.75 49.29,33.69 48.2,34.78 U$3.IO4
  Bottom 0.152: v74.97,25.58 74.97,26.68 73.88,27.77 65.29,27.77 64.71,28.35 62.12,28.35 61.28,27.52 61.05,27.52 60.98,27.59 59.47,27.59 58.43,26.55 58.43,25.66 58.08,25.31 58.08,24.42 v57.11,23.45 | v52.44,23.17 50.86,23.17 v49.47,24.57 | R12.1 44.24,31.15 45.94,31.15 46.72,31.93 46.72,33.71 47.79,34.78
  Bottom 0.2: U$3.IO4 47.79,34.78
IO14  (via drill 0.35)
  Top 0.152: IO14.2 59.19,24.9 58.2,25.89 v57.87,25.89 | v49.95,12.3 50.23,12.02 50.23,11.18 49.77,10.73 32.98,10.73 v32.78,10.93 | v28.87,24.62 24.29,29.2 v24.29,29.39
  Bottom 0.152: v57.87,25.89 56.48,24.49 56.48,23.86 55.99,23.37 53.35,23.37 53.12,23.15 53.12,22.74 52.79,22.41 52.21,22.41 51.93,22.69 50.3,22.69 49.59,21.98 49.59,13.09 49.95,12.73 v49.95,12.3 | v32.78,10.93 32.32,10.93 30.77,12.48 30.75,12.48 30.11,13.11 29.78,13.11 28.41,14.48 28.41,24.1 28.87,24.56 v28.87,24.62
  Bottom 0.2: R11.1 v24.29,29.39 22.89,30.78 21.36,30.78 U$3.TMS
IO15  (via drill 0.35)
  Top 0.152: IO15.2 59.11,26.71 60.55,25.27 60.55,23.36 60.45,23.25 57.96,23.25 57.77,23.44 57.77,24.14 57.44,24.47 55.69,24.47 v55.54,24.31
  Bottom 0.152: v55.54,24.31 52.97,24.31 48.78,28.51 46.29,28.51 45.55,27.77 45.55,27.41 U$3.TD0 44.41,26.27 44.41,26.19 44.08,25.87 43.35,25.87 R8.1
IO25  (via drill 0.35)
  Top 0.152: 58.85,31.6 IO25.2 59.39,31.6 59.39,32.13 59.93,32.67 v60.95,32.67 | v49.59,37.37 49.57,37.4 49.57,42.04 49.21,42.4 U$3.IO25
  Bottom 0.152: R23.1 44.18,43.46 45.74,43.46 46.8,42.4 U$3.IO25 | v49.59,37.37 49.59,37.29 50.86,36.02 50.86,34.77 53.45,32.19 60.5,32.19 60.7,32.38 60.7,32.42 v60.95,32.67
IO27  (via drill 0.35)
  Top 0.152: v53.48,29.09 53.53,29.09 53.99,28.63 54.32,28.63 54.7,28.26 IO27.2 | v49.87,31.6 49.87,33.56 49.57,33.86 49.57,33.84 48.96,34.45 48.96,37.93 49.21,38.18 49.21,40.27 48.14,41.34 47.4,41.34 46.78,41.96 46.78,43.05 46.62,43.21 46.62,43.72 U$3.IO27
  Bottom 0.152: R24.1 43.8,46.03 43.8,44.61 44.53,43.88 45.74,43.88 45.81,43.95 46.85,43.95 U$3.IO27 | v53.48,29.09 50.97,31.6 v49.87,31.6
IO32  (via drill 0.35)
  Top 0.2: v62.12,32.52 62.36,32.52 62.65,32.22 63.15,32.22 63.3,32.08 63.3,31.58 IO32.2
  Bottom 0.152: R19.1 44.86,38.37 44.86,38.38 46.36,38.38 47.68,39.69 U$3.IO32
  Bottom 0.2: v62.12,32.52 61.92,32.52 61.19,33.25 60.71,33.25 60.37,32.91 60.37,32.52 53.58,32.52 51.19,34.91 51.19,36.16 50.99,36.36 50.99,37.06 51.11,37.18 51.11,37.93 49.35,39.69 47.68,39.69
IO33  (via drill 0.35)
  Top 0.152: IO33.2 63.27,27.82 63.27,28.35 63.16,28.45 62.26,28.45 62.14,28.33 v61.28,28.33 | v42.79,23.55 42.33,23.1 39.2,23.1 v38.47,23.83
  Bottom 0.152: v61.28,28.33 59.22,28.33 v56.88,25.99 56.09,25.2 56.09,24.08 55.84,23.83 55.84,23.73 52.59,23.73 v49.92,26.4 49.62,26.09 44.84,26.09 43.75,25 43.75,23.76 43.55,23.55 v42.79,23.55 | v38.47,23.83 37.86,24.44 32.42,24.44 31.05,25.81 31.05,37.04 31.08,37.07 30.12,38.02 30.12,38.07 28.16,40.04 26.14,40.04 R20.1
  Bottom 0.2: R20.1 24.51,38.4 21.99,38.4 20.91,37.32 U$3.IO33
LED  (via drill 0.35)
  Top 0.2: v43.85,26.42 42.51,26.42 40.63,24.54 v39.33,24.54 | v30.77,23.4 30.77,23.02 30.32,22.57 29,22.57 28.28,21.85 28.28,15.47 25.16,12.35 16.63,12.35 16.55,12.44 v16.23,12.44
  Bottom 0.2: U$3.IO2 46.84,29.7 45.75,28.61 44.75,28.61 43.85,27.72 v43.85,26.42 | v39.33,24.54 39.05,24.26 39.05,23.59 38.71,23.25 38.06,23.25 37.58,23.73 31.28,23.73 30.95,23.4 v30.77,23.4 | 15.06,10.07 15.06,10.09 | 15.06,10.09 15.06,11.27 v16.23,12.44 | 14.57,9.92 R3.1 15.06,10.09
LEDVCC
  Top 0.152: 92.28,18.16 91.59,18.16
  Top 0.2: 92.37,18.07 92.28,18.16
  Top 0.6: 91.41,18.12 91.37,18.07 90.54,18.07 90.54,18.13
  Top 0.8: 91.59,18.16 91.45,18.16 91.41,18.12
  Top 2: J4.3 96.45,13.99 92.37,18.07
  pour Top (no thermals): 88.02,18.98 88.02,17.1 88.18,16.95 89.14,16.92 89.32,16.87 89.57,17.18 91.73,17.18 91.91,17.38 91.91,18.8 91.19,19.06 88.1,19.06
LEVEL1  (via drill 0.35)
  Top 0.152: v18.12,28.89 18.12,33.41 18.1,33.43 18.1,40.6 U$3.SVN | v12.51,28.78 14.14,28.78 v14.49,28.43
  Bottom 0.152: 14.41,28.53 15.29,29.41 RN2.5 15.6,30.77 16.92,29.45 17.56,29.45 v18.12,28.89 | 14.41,28.53 12.04,26.16 12.04,21.2 LEVEL1-IO39.3 | v12.51,28.78 11.31,27.59 10.78,27.59 10.01,26.82 CN1.5 | v14.49,28.43 14.49,28.46 14.41,28.53
LEVEL2  (via drill 0.35)
  Top 0.152: v18.66,33.66 18.66,38.21 19.9,39.45 U$3.IO35
  Bottom 0.152: v18.66,33.66 18.66,29.85 18.55,29.75 17.05,29.75 16.44,30.36 16.44,30.83 15.96,31.31 15.65,31.31 RN2.6 14.17,31.66 13.78,31.27 13.78,29.06 11.57,26.85 11.57,26.8 11.24,26.48 10.84,26.48 10.2,25.84 10.19,25.84 9.61,25.26 9.61,24.47 4.92,19.77 3.98,19.77 | LEVEL2-IO35.3 3.98,19.77 | CN1.6 8.16,24.84 6.11,22.79 6.11,22.74 4.92,22.74 4.36,23.3 3.54,23.3 2.96,22.72 2.96,21.9 2.91,21.85 2.91,20.83 3.98,19.77
LEVEL3
  Bottom 0.152: U$3.IO34 17.21,34.78 16.17,33.74 16.17,33.02 15.96,32.81 15.65,32.81 RN2.7 11.6,32.46 LEVEL4-IO36.3 8.93,33.48 7.36,31.92 CN1.2
LEVEL4
  Bottom 0.152: 5.12,33.26 6.49,34.63 11.42,34.63 12.18,33.86 14.79,33.86 RN2.8 17.85,35.91 17.96,35.91 18.1,36.05 18.1,39.46 17.95,39.61 17.95,45.09 19.09,46.23 22.11,46.23 22.44,45.9 U$3.SVP | 5.12,33.26 4.13,33.26 LEVEL3-IO34.3 | CN1.1 6.44,28.8 6.44,32.42 5.6,33.26 5.12,33.26
LIMIT1  (via drill 0.35)
  Top 0.152: J7.1 82.79,43.72 81.14,42.07 73.11,42.07 73.04,42.14 72.6,42.14 v72.38,42.37 | v57.54,33.26 58.31,32.49 IO25.3 | 59.82,25.15 58.4,26.58 57.84,26.58 57.66,26.76 57.66,28.34 56.78,29.22 56,29.22 55.88,29.09
  Top 0.2: IO14.3 59.82,24.33 59.82,25.15 | IO25.3 57.06,31.34 55.98,32.42 53.59,32.42 53.24,32.06 53.24,30.48 53.72,30.01 53.72,29.72 54.36,29.07 55.14,29.07 55.16,29.09 55.88,29.09
  Bottom 0.152: v72.38,42.37 69.81,42.37 63.97,36.53 63.97,33.59 63.64,33.26 61.65,33.26 61.32,33.58 60.57,33.58 60.25,33.26 v57.54,33.26
LIMIT2  (via drill 0.35)
  Top 0.152: J8.1 88.86,42.35 88.1,41.59 80.99,41.59 80.91,41.66 80.45,41.66 80.35,41.56 v72.4,41.56 | IO32.3 64.35,33.41 64.45,33.51 64.45,33.76 v64.63,33.94
  Top 0.2: IO32.3 IO33.3
  Bottom 0.152: v64.63,33.94 64.63,36.71 69.48,41.56 v72.4,41.56
MOSFETGND1  (1 unrouted)
  Bottom 2: X1.2 59.6,4.5 Q1.4
MOSFETGND2  (1 unrouted)
  Bottom 2: X2.2 67.36,5.18 65.39,7.14 64.86,7.14 64.5,7.5 Q2.4
MOSFETGND3  (1 unrouted)
  Bottom 2: X3.2 75.09,5.07 Q3.4
MOSFETGND4  (1 unrouted)
  Bottom 2: X4.2 82.82,5.37 Q4.4
MOSFETVCC1  (via drill 0.35)
  Top 0.152: 62.8,18.22 62.88,18.14 JP4.1 64.15,18.14 | v62.8,16.54 62.8,15.68
  Top 0.6: 65.31,12.68 64.82,12.19 | JP1.1 64.92,10.5 64.82,10.6 | v62.8,16.54 62.8,16.8 64.15,18.14
  Top 2.4: X2.1 64.82,5.29 | 64.82,5.29 64.82,10.6 64.82,12.19 62.73,14.28 57.24,14.28 56.48,15.04 SERVO1.2 | X1.1 57.06,4.27 58.08,5.29 64.82,5.29
  Bottom 0.6: SERVO1.2 56.48,20.16 C8.2 | C5.1 62.8,18.11 v62.8,16.54
  pour Top (no thermals): 64.35,18.95 64.17,19.13 62.37,19.13 62.17,18.93 62.17,17.51 61.89,17.23 60.87,17.23 60.21,16.57 60.21,15.5 61.58,14.13 64.63,14.13 64.63,15.83 64.35,16.11
  pour Top (no thermals): 65.01,12.15 65.67,12.81 66.94,12.81 68.29,11.46 68.29,9.61 67.86,9.18 65.27,9.18 65.01,9.43
MOSFETVCC2  (via drill 0.35)  (1 unrouted)
  Top 0.6: 70.24,12.25 70.39,12.25 72.55,14.41 72.55,12.72 70.42,10.6 68.95,10.6 JP1.2 | JP6.1 78.45,18.22 79.31,18.22 79.29,18.19 JP6.1 | v78.7,16.54 78.42,16.82 JP6.1
  Top 2: J1.2 89.27,7.32
  Top 2.4: 89.27,7.32 88.78,7.8 80.56,7.8 | X4.1 80.28,8.31 | 80.28,8.31 | X3.1 72.55,8.06 | 72.55,8.06 72.55,14.41 72.55,17.88 SERVO2.2 | 72.55,8.06 72.8,8.31 80.28,8.31
  Bottom 0.6: C10.2 77.86,20.23 78.83,19.26 C6.1 78.83,16.67 v78.7,16.54
  pour Top (no thermals): 78.27,17.51 77.91,17.15 73.09,17.15 72.45,16.52 72.45,14.48 73.01,13.93 79.08,13.93 80.43,15.27 80.43,18.32 79.97,18.78 78.27,18.78
  pour Top (no thermals): 68.57,9.91 68.57,11.39 71.34,14.15 71.67,14.15 71.67,9.35 71.36,9.05 69.25,9.05 68.59,9.71 68.59,9.89
N$1  (via drill 0.35)
  Top 0.2: v6.64,6.33 7.3,5.67 7.3,3.97 7.35,3.92 5VOK.C
  Bottom 0.2: R2.1 7.57,5.41 v6.64,6.33
N$2  (via drill 0.35)
  Top 0.2: v6.77,7.22 8.03,7.22 STATUS.C
  Bottom 0.2: v6.77,7.22 7.34,7.79 7.34,8.06 9.04,9.76 R3.2
N$6  (via drill 0.35)
  Top 0.2: 3V3OK.C 9.43,1.99 | 9.43,1.99 9.49,2.05 | v12.48,1.33 12.48,1.61 12.1,1.99 9.43,1.99
  Bottom 0.2: R1.1 10.3,4.25 10.3,3.51 v12.48,1.33
N$10  (via drill 0.35)
  Top 0.152: v81.5,32.24 81.75,32.24 82.13,32.62 85.3,32.62 87.75,30.17 S1.A
  Bottom 0.152: RN3.4 81.37,32.37 v81.5,32.24
N$11  (via drill 0.35)
  Top 0.152: v81.57,33.15 86.35,33.15 S2.A
  Bottom 0.152: RN3.3 81.46,33.26 v81.57,33.15
N$12  (via drill 0.35)
  Top 0.152: v81.57,34.04 87.24,34.04 S3.A
  Bottom 0.152: RN3.2 81.55,34.06 v81.57,34.04
N$13  (via drill 0.35)
  Top 0.152: v81.67,35.03 81.95,35.31 S4.A
  Bottom 0.152: RN3.1 80.74,35.03 v81.67,35.03
N$52
  Bottom 0.3: R6.2 88.11,20.01 87.54,20.58 87.54,22.13 88,22.59 74LVC1.5
N$74
  Bottom 0.3: 74LVC1.4 90.67,23.54 R7.2
PIO1  (via drill 0.35)
  Top 0.152: v30.47,36.46 23.3,36.46 U$3.IO19 | v50.79,12.27 50.79,11.66 50.59,11.46 50.59,11.11 49.9,10.42 33.06,10.42 33.01,10.37 32.55,10.37 32.47,10.45 32.24,10.45 32.02,10.67 31.16,10.67 v30.9,10.93 29.88,11.94 v29.88,12.55
  Bottom 0.152: Q1.1 52.39,13.82 50.84,12.27 v50.79,12.27 | v30.47,36.46 30.54,36.38 30.54,27.77 30.16,27.39 30.16,26.83 28.03,24.7 28.03,14.31 28.13,14.31 v29.88,12.55
  Bottom 0.2: R18.1 23.22,36.54 U$3.IO19 | SERVO1.3 59.02,17.88 57.17,16.04 54.98,16.04 54.17,15.22 Q1.1
PIO2  (via drill 0.35)
  Top 0.152: v29.12,34.02 23.2,34.02 U$3.IO23 | v31.79,10.12 32.37,10.12 32.42,10.07 49.98,10.07 v51.14,11.23
  Bottom 0.152: Q2.1 62.19,13.01 61.07,11.89 51.8,11.89 v51.14,11.23 | v31.79,10.12 31.66,10.25 31.66,11.11 30.77,12 29.65,12 29.33,12.32 29.33,12.58 27.57,14.33 27.57,24.67 29.86,26.96 29.86,33.28 v29.12,34.02
  Bottom 0.2: R16.1 23.07,34.15 U$3.IO23
PIO3  (via drill 0.35)
  Top 0.152: v51.42,10.32 50.69,10.32 50.07,9.7 50.05,9.71 32.25,9.71 32.09,9.56 31.2,9.56 30.92,9.84 v30.92,9.99 | v29.1,32.04 25.9,32.04 25.69,32.24 U$3.IO5
  Bottom 0.152: Q3.1 69.18,13.82 66.87,11.51 52.62,11.51 v51.42,10.32 | v30.92,9.99 30.75,9.99 30.75,10.32 30.69,10.37 30.67,10.37 30.34,10.7 30.34,10.98 29.63,11.69 29.53,11.69 29.02,12.2 29.02,12.3 27.22,14.1 27.22,24.75 29.55,27.08 29.55,31.58 v29.1,32.04
  Bottom 0.2: R13.1 24.55,32.24 U$3.IO5 | 72.5,16.11 74.51,16.11 74.99,16.59 SERVO2.3
  Bottom 0.3: Q3.1 70.22,15.3 71.03,16.11 72.5,16.11
PIO4  (via drill 0.35)
  Top 0.152: v51.52,9.33 32.88,9.33 32.5,8.95 v31.05,8.95 | v83.35,22.29 83.32,22.31 RGB.1
  Bottom 0.152: v51.52,9.33 51.52,9.63 51.98,10.09 51.98,10.21 52.97,11.21 67.17,11.21 68.26,12.3 76.72,12.3 Q4.1 78.52,13.54 78.52,12.27 83.68,12.27 83.94,12.54 83.94,21.51 83.32,22.13 83.32,22.27 v83.35,22.29 | v31.05,8.95 31.05,8.98 30.04,9.99 30.04,10.85 29.5,11.39 29.4,11.39 28.72,12.07 28.72,12.17 26.99,13.9 26.91,13.9 26.91,25.31 26.19,26.03 26.18,26.03 25.2,27.01 R9.1
  Bottom 0.2: R9.1 22.59,27.01 U$3.TCK
RGB3V3  (via drill 0.35)
  Top 0.152: 85.76,23.48 85.78,23.46 v85.83,23.46 85.46,23.83 RGB.2
  Bottom 0.2: 74LVC1.3 85.83,23.49 v85.83,23.46
RGB5V
  Bottom 0.152: J4.2 96.2,17.49 92.12,21.56 R7.1
SCL  (via drill 0.35)
  Top 0.152: v47.31,22.31 47.31,23.16 46.78,23.69 46.78,40.08 45.3,41.56 U$3.IO22 45.3,41.36 44.24,40.3 44.24,40.09 43.85,39.71 36.74,39.71 35.75,40.7 34.38,40.7 33.13,39.45 27.98,39.45 23.5,43.93 23.5,45.38 22.52,46.36 13.75,46.36 13.2,46.92 12.74,46.92 12.18,46.36 11.52,46.36 11.06,45.9 CONN1.4
  Top 0.2: v11.01,42.83 11.01,44.97 CONN1.4 | v39.43,44 43.7,44 U$3.IO22
  Bottom 0.152: R22.2 43.06,42.4 U$3.IO22 45.48,42.4 46.55,41.33 | 46.55,41.33 46.6,41.28 | K1.2 48.32,21.3 v47.31,22.31 | 46.55,41.33 54.98,41.33 56.1,42.45 56.1,48.29 J9.4 | 10.58,14.56 10.58,15.07 10.27,15.37 9.84,15.37 9.26,15.96 7.5,15.96 6.28,14.74 3.08,14.74 3.06,14.71
  Bottom 0.2: CONN2.4 16.75,12.99 14.51,15.23 14.51,15.45 14.08,15.88 11.9,15.88 10.58,14.56 9.36,13.34 J12.1 | 3.06,14.71 1.05,16.72 1.05,38.74 4.81,42.5 11.01,42.5 v11.01,42.83 | IC1.6 37.63,46.94 37.63,44.23 37.86,44 v39.43,44
  Bottom 0.4: K1.2 48.32,4.82
SD0
  Top 0.6: JP14.1 61.48,47.99 J9.2
SDA  (via drill 0.35)
  Top 0.152: v46.29,22.21 46.29,24.11 46.47,24.29 46.47,38.82 45.43,39.86 45.38,39.86 | 45.38,39.86 U$3.IO21 | CONN1.3 12.12,44.96 12.18,44.9 12.18,43.94 12.32,43.8 23.15,43.8 27.85,39.1 33.31,39.1 34.48,40.27 35.6,40.27 36.59,39.28 36.59,39.25 44.77,39.25 45.38,39.86 | v10.76,15.68 9.73,14.66 9.7,14.66 9.56,14.52 9.56,13.42 9.71,13.27 11.98,13.27 12.3,13.59 12.3,14.05 12.08,14.28 v12.08,14.63
  Top 0.2: v11.75,41.99 11.75,43.11 12.12,43.48 12.12,44.96 | v43.88,41.43 43.88,42.98 43.47,43.39 39.72,43.39 39.67,43.34 39.1,43.34 38.65,43.8 38.65,47.81 v38.9,48.06 | v12.08,14.63 12.64,15.19 15.36,15.19 v15.59,14.97
  Bottom 0.152: 49.04,5.65 K1.1 | K1.1 49.49,5.2 | 49.69,5.75 K1.1 | R21.2 44.6,40.56 U$3.IO21 46.41,40.96 | 46.42,40.98 46.41,40.96 | K1.1 49.32,6.54 48.71,7.15 48.71,21.7 47.54,22.86 47.08,22.86 46.42,22.21 v46.29,22.21 | 46.41,40.96 56.54,40.96 58.61,43.03 J9.3 | 3.37,15.07 6.18,15.07 7.4,16.29 9.36,16.29 9.97,15.68 v10.76,15.68
  Bottom 0.2: CONN2.3 16.25,13.99 15.17,15.07 15.27,14.97 v15.59,14.97 | 3.37,15.07 1.55,16.88 1.55,38.74 4.8,41.99 v11.75,41.99 | R21.2 43.58,41.43 v43.88,41.43 | IC1.4 38.04,48.21 38.32,48.21 38.47,48.06 v38.9,48.06 | J12.2 10.36,13.3 11.69,14.63 v12.08,14.63
SERVO1  (via drill 0.35)
  Top 0.152: IO27.3 54.13,27.31 54.13,26.81 54.28,26.66 v54.28,26.21 | v65.24,36.43 65.24,35.34 64.07,34.17 64.07,33.56 63.67,33.15 62.55,33.15 62.47,33.07 61.89,33.07 61.56,32.75 61.56,32.17 v61.15,31.76 | v72.2,40.75 72.45,41.01 72.85,41.01 72.98,41.13 77.41,41.13 77.43,41.1 v80.68,41.1
  Top 0.2: v54.28,26.21 54.28,26.13 55.5,24.91 57.61,24.91 IO14.1
  Bottom 0.152: v54.28,26.21 54.28,28.31 56.28,30.31 56.28,30.46 57.57,31.76 v61.15,31.76 | v65.24,36.43 69.56,40.75 v72.2,40.75 | v80.68,41.1 79.36,42.42 SERVO4.3
SERVO2  (via drill 0.35)
  Top 0.152: v81.52,40.7 81.06,40.7 80.91,40.55 77.58,40.55 77.31,40.82 73.1,40.82 v72.22,39.95 | v64.99,33.05 65.29,32.75 65.29,26.37 65.16,26.24 63.03,26.24 62.73,26.55 IO33.1
  Top 0.2: IO33.1 61.53,27.55 61.49,27.52 59.95,27.52 IO15.3
  Bottom 0.152: v81.52,40.7 81.06,40.7 80.91,40.55 80.25,40.55 SERVO3.3 | v72.22,39.95 71.83,39.95 71.44,40.34 69.63,40.34 65.8,36.5 65.8,36.2 65.19,35.59 65.19,33.71 65.14,33.66 65.14,33.2 v64.99,33.05
SERVOVCC
  Top 0.6: JP13.1 75.73,35.74 74.94,35.74
  Top 1.8: SERVO3.2 76.82,38.75 75.73,37.66 75.54,37.66 74.94,37.07 74.94,35.74 74.94,34.04
  Bottom 2.4: SERVO3.2 SERVO4.2
  pour Top (no thermals): 73.85,34.02 73.85,33.33 74.28,32.9 75.93,32.9 76.11,33.08 76.11,34.17 76.21,34.27 76.21,34.96 75.83,35.34 74.31,35.34 73.9,34.93 73.85,34.88 73.85,34.04
STEPPER1  (via drill 0.35)
  Top 0.152: S1.C 93.02,26.8 93.63,26.8 v93.73,26.91
  Bottom 0.152: v93.73,26.91 ULN1.17
  Bottom 0.6: ULN1.18 ULN1.17 93.99,27.79 X8.2
STEPPER2  (via drill 0.35)
  Top 0.152: v93.73,29.42 92.72,29.42 90.39,31.76 S2.C
  Bottom 0.152: 93.74,29.65 v93.74,29.43 v93.73,29.42
  Bottom 0.6: X8.3 93.99,30.33 ULN1.15 93.74,29.65 ULN1.16
STEPPER3  (via drill 0.35)
  Top 0.152: v93.73,32.04 92.16,32.04 90.67,33.53 S3.C
  Bottom 0.152: ULN1.13 v93.73,32.04
  Bottom 0.6: X8.4 93.99,32.87 ULN1.13 ULN1.14
STEPPER4  (via drill 0.35)
  Top 0.152: v93.73,34.63 91.43,34.63 90.74,35.31 S4.C
  Bottom 0.152: ULN1.11 v93.74,34.63 v93.73,34.63
  Bottom 0.6: X8.5 94.22,35.41 93.85,35.05 | 93.85,35.05 94.01,34.89 v93.74,34.63 ULN1.12 | 93.85,35.05 ULN1.11
STEPPERA  (via drill 0.35)
  Top 0.152: IO27.1 55.51,27.92 v56.17,28.58 | v76.4,29.27 76.65,29.02 76.65,28.81 77,28.45 86.02,28.45 v86.07,28.51
  Bottom 0.152: RN1.4 81.19,26.7 82.03,27.54 82.99,27.54 83.02,27.51 83.91,27.51 ULN1.2 85.1,27.54 v86.07,28.51 | v76.4,29.27 75.74,28.61 65.72,28.61 64.73,29.6 61.71,29.6 61.48,29.37 57.82,29.37 57.06,28.61 56.2,28.61 v56.17,28.58
  Bottom 0.6: ULN1.1 ULN1.2
STEPPERB  (via drill 0.35)
  Top 0.152: IO25.1 60.96,30.31 v61.1,30.31 | v80.58,30.28 83.73,30.28 ULN1.4
  Bottom 0.152: ULN1.4 ULN1.3 | v61.1,30.31 65.21,30.31 66.13,29.39 74.89,29.39 75.91,30.41 80.46,30.41 v80.58,30.28 | RN1.3 81.22,27.6 82.41,28.78 83.68,28.78
  Bottom 0.2: ULN1.3 83.91,28.78 83.68,28.78
  other vias: 83.93,30.08
STEPPERC  (via drill 0.35)
  Top 0.152: IO0.3 56.62,30.23 v56.83,30.23 | v77.46,29.85 79.36,29.85 80.35,30.84 80.38,30.84 80.43,30.89 v83.25,30.89
  Bottom 0.152: RN1.2 80.6,28.37 81.27,28.37 82.59,29.69 82.59,31.71 82.84,31.96 83.93,31.96 | v56.83,30.23 60.31,30.23 60.79,29.75 61.33,29.75 61.53,29.95 64.96,29.95 65.9,29.01 75.1,29.01 76.03,29.95 77.36,29.95 v77.46,29.85 | v83.25,30.89 83.71,31.35 ULN1.5
  Bottom 0.6: ULN1.5 83.93,31.96 ULN1.6
STEPPERD  (via drill 0.35)
  Top 0.152: IO15.1 58.37,27.63 58.37,28.37 58.65,28.66 60.69,28.66 61,28.96 v61.86,28.96 | v77.2,29.04 81.15,29.04 v81.73,29.62
  Bottom 0.152: RN1.1 81.4,29.29 v81.73,29.62 82.21,30.1 82.21,33.99 82.74,34.53 83.93,34.53 | v61.86,28.96 64.68,28.96 65.47,28.18 76.34,28.18 v77.2,29.04
  Bottom 0.6: ULN1.7 83.93,34.53 ULN1.8
STEPPERVCC  (via drill 0.35)
  Top 0.6: v92.21,23.43 92.05,23.26 | 92.05,23.26 91.68,22.89 | JP10.1 88.99,23.78 89.51,23.26 92.05,23.26
  Bottom 0.6: v92.21,23.43 92.21,35.87 92.77,36.43 ULN1.10
  Bottom 1: X8.1 97.57,24.54 96.43,23.4 92.82,23.4 92.8,23.43 v92.21,23.43
  pour Top (no thermals): 87.95,23.86 88.38,24.01 92.14,23.98 92.6,23.53 92.6,22.64 91.76,21.8 89.83,21.8 89.75,21.72 88.02,21.72 87.92,21.82 87.92,23.83
TURBINETACH  (via drill 0.35)
  Top 0.152: v21.02,22.26 21.02,38.44 U$3.IO18
  Bottom 0.152: v21.02,22.26 19.8,21.04 19.8,12.18 R5.2 17.4,8.44 17.24,8.28 17.24,5.93 16.95,5.65 16.83,5.52 X7.2
TURBINETHERM  (via drill 0.35)
  Top 0.152: U$3.IO26 22.44,41.36 23.5,40.3 23.5,39.42 22.88,38.8 21.94,38.8 21.38,38.24 21.38,22.73 21.81,22.31 21.83,22.31 v21.86,22.33
  Bottom 0.152: v21.86,22.33 24.74,19.45 24.74,9.25 | 24.74,9.25 24.74,8.06 | 24.74,9.25 R4.2
  Bottom 0.2: X6.1 24.55,7.87 24.74,8.06
VIN1  (via drill 0.35)
  Top 0.152: JP4.2 65.9,18.14 | JP11.2 77.3,33.71 | J11.4 37.39,21.07 37.44,21.07
  Top 0.2: v67.6,21.57 66.92,20.89 66.92,20.81 66.87,20.76 67.5,20.12 v67.63,20.12 | 73.38,31.32 72.96,31.75 72.96,32.19
  Top 0.3: 81.85,27.13 81.85,27.11 82.12,26.84
  Top 0.6: v77.1,34.78 77.3,34.58 77.3,33.71 | JP10.2 88.67,24.89 88.76,24.97 | JP11.2 76.75,32.08 76.69,32.03 | 74.65,32.03 73.12,32.03 | 73.12,32.03 72.96,32.19 | 73.12,32.03 72.02,32.03 71.69,31.7 | 66.59,46.64 J6.1 66.61,46.9
  Top 1: 88.76,24.97 87.9,25.74 86.71,25.74 85.31,27.13 81.85,27.13 76.06,27.1 74.36,28.86 74.36,31.73
  Top 1.8: 77.3,33.71 77.3,32.64 76.69,32.03 74.65,32.03 74.36,31.73
  Top 2: 37.44,21.07 39.74,18.78 45.89,18.78 51.91,24.81 51.91,35.64 | 51.91,35.64 51.88,35.68 51.88,37.73 54.04,39.88 59.83,39.88 66.59,46.64 | 51.91,35.64 52.78,34.78 U$8.P$4 U$8.P$3 | 67.72,36.96 67.72,35.1 J10.1 66.59,34.53 66.59,35.68 66.69,35.79
  Top 2.4: 65.9,18.14 66.87,19.11 66.87,20.76 J10.1 66.87,31.78 66.95,31.7 70.42,31.7 71.69,31.7 73.75,31.7 73.79,31.73 74.36,31.73
  Top 4: J6.1 66.87,38.31 67.69,37.48 67.69,36.99 67.72,36.96
  Bottom 0.2: C9.1 | 66.94,48.37 U$10.P$1 66.94,46.72 J6.1
  Bottom 0.6: v77.1,34.78 76.86,34.54 C13.2
  Bottom 0.8: v67.63,20.12 67.63,20.56 C9.1 | v67.6,20.83 v67.6,21.57
  pour Top (no thermals): 65.32,19.29 64.73,19.29 64.73,17.2 65.01,16.92 65.65,16.92 66,17.28 66,18.83 65.57,19.26 65.34,19.26
VIN2
  Top 0.2: 88.61,15.27 89.06,15.27 90.49,16.69
  Top 0.6: 81.95,17.69 81.55,17.69 JP7.2
  Top 1: 94.32,8.36 J3.2 96.99,8.41 97.08,8.5
  Top 2.4: J3.2 95.52,8.36 88.61,15.27 83.84,15.27 83.82,15.25 81.95,15.25 81.95,17.69
  Bottom 0.2: 97.9,8.16 97.09,8.16 96.99,8.16 J3.2
  Bottom 1: U$4.P$1 97.14,8.21 97.09,8.16
  pour Top (no thermals): 89.8,16.8 88.63,15.63 88.73,14.61 89.57,13.77 91.1,13.77 91.48,14.15 91.71,14.15 91.71,16.54 91.38,16.8 90.23,16.8 89.8,16.77

## Text on the board
tPlace: rst | tx | 3V3 | CS | + - | svp | 27 | BME680 | Qwiic | SCL | Stemma | rx | Add | GND | 26 | 25 | + S - | S1 | 22 | Air Sensor | - L1 | - L2 | WATERMETER | + - | LEVEL4:IO36 | LEVEL3:IO34 | 18 | 32 | 3V3 | + - | 21 | LIMIT / SWITCH | btn | DC INPUT / VIN1 | Servo | 17 | USBC V | + - | 4 | 3V> | S2 | io16 | 0 | FS | SC | L1 | SB | FS | L2 | 5V> | SERVO / <VCC | VIN1> | gnd | SA-SB-SC-SD | 2 | 5v | S1 | SA | SD | S2 | S2 | L2 | STEPPER | FS:Fan Signal / S1-S2:Servo / SA-SD:Stepper / L1-L2:LimitSwitch | LEVEL2:IO35 | LEVEL1:IO39 | sd1 | io15 | S1 | L1 | IO4> | VIN1> | STEP / VCC | 5V | GND | VIN1 | RGB< | sd0 | clk | GPIO Selector | IO13> | > | STEP / VCC | 5V> | 5V | GND | VIN1 | > | LED / VCC | 5V> | MOSFET / <VCC1 | VIN1> | 5V> | MOSFET / <VCC2 | VIN2> | LEDVCC-S-GND | Aux1 | Aux2 | VIN2> | smartLED | BTN:IO12 / STATUS LED:IO2 | - + S | - + S | Edward Terra Controller 2022 v2 | IO19 | IO5 | IO4 | + | TURBINE | MOSFET / VCC1> | MOSFET / <VCC2 | 5V | Flow | Thermistor | 1 WIRE | POWER OUTPUT | PWM:IO16 | VIN2 | + - | IO18 | IO26 | FAN | - | IO17 | IO19 | IO23 | IO5 | IO13 | SIG | - S 3V3 | AO-3V3 | 3V3 - S | M1 | + - | M2 | + - | M3 | + - | M4 | + - | + - | 3V3 | SDA
bPlace: GND | RST | TX | GND | 3V3 | Terra Controller / V1-2022 / max.schmit@ / gmail.com | BME680 | 3V3 | GND | SCL | SDA | ADD | CS | S1 | NC | L1 GND | L2 GND | 26 | ADD | + - | GND | SERVO / VCC | SIG | C:0x77 / NC:0x76 | LIMIT | VIN1 | S2 | LEVEL3 / IO34 | LEVEL4 / IO36 | 18 | SERVO | 3V3 | + - | 3V3 / WHITE | + - | Stepper | ANODE / BLUE | 34 | SD | ANALOG / YELLOW | VCC1 | + - | SC | GND / RED | SB | + - | LEVEL2 / IO35 | LEVEL1 / IO33 | R17:1-WIRE:I017 / R15:BTN1 / R14:FPWM:IO16 / R12:RGB:IO4 / R10:IO0 / R8:IO15 | SA | VCC | RN4 | CMD | SD3 | SD0 | CLK | R20:IO33 / R18:PIO1:IO19 / R16:PIO2:IO23 / R13:PIO3:IO5 / R11:IO14 / R9:PIO4:IO13 | VCC1 | GND | 5V | GND | GND | PIO1 | RN2 | R24:IO27 / R23:IO25 / R22:SCL:IO22 / R21:SDA:IO21 / R19:IO32 / R5:IO18 | GND | PIO3 | smartLED | DATA | GND | MVCC1 | MVCC2 | 3V3 | SDA | LED / VCC | SCL | SCL | SDA | 3V3 | Mosfet:PIO | + - | 5V | VIN2 | + - | 3V3 | GND | SCL | SDA | M1:IO19 | M2:IO23 | M3:IO5 | M4:IO13 | FAN:IO16 | + - | + - | + - | + - | S + - | GND | FlowS / IO18 | 3V3 | Therm / IO26 | 3V3 | 3V3 | GND | 1-Wire / IO17 | SDA | Turbine | Turbine | Sensor 1Wire | 3V3 | Tach | VCC3 | GND